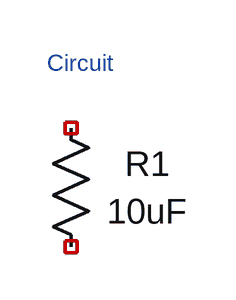
[diagram p0: schematic circuit.asc]
circuit.asc, the LTspice schematic file:
Version 4
SHEET 1 160 208
SYMBOL res 64 128 R0
WINDOW 0 68 40 Center 2
WINDOW 3 68 72 Center 2
SYMATTR InstName R1
SYMATTR Value 10uF
TEXT 64 100 Left 1 ;Circuit

The netlist it stands for:
* circuit.asc
R1 NC_01 NC_02 10uF
* Circuit
.backanno
.end